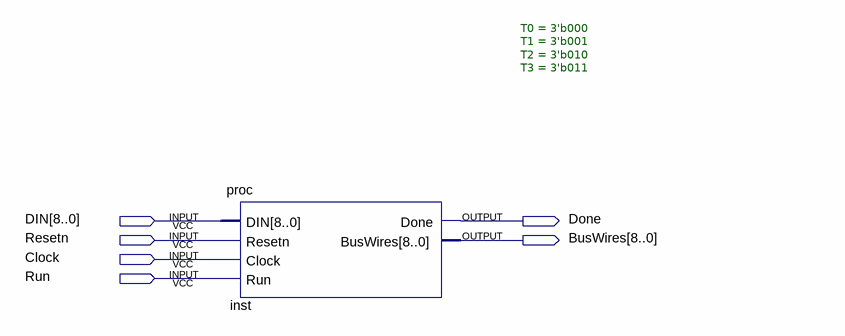
[diagram p0: schematic sheet]
// Quartus schematic Lab9Part1.bdf as structural Verilog: 1 symbols, 6 pins
module Lab9Part1 (
  input  [8:0] DIN,
  input  Resetn,
  input  Clock,
  input  Run,
  output Done,
  output [8:0] BusWires
);

  proc #(.T0(3'b000), .T1(3'b001), .T2(3'b010), .T3(3'b011)) inst (
    .DIN(DIN), .Resetn(Resetn), .Clock(Clock), .Run(Run), .Done(Done), .BusWires(BusWires));
endmodule
